# Altium schematic sheet RS232_485_SDcard.SchDoc
size A4
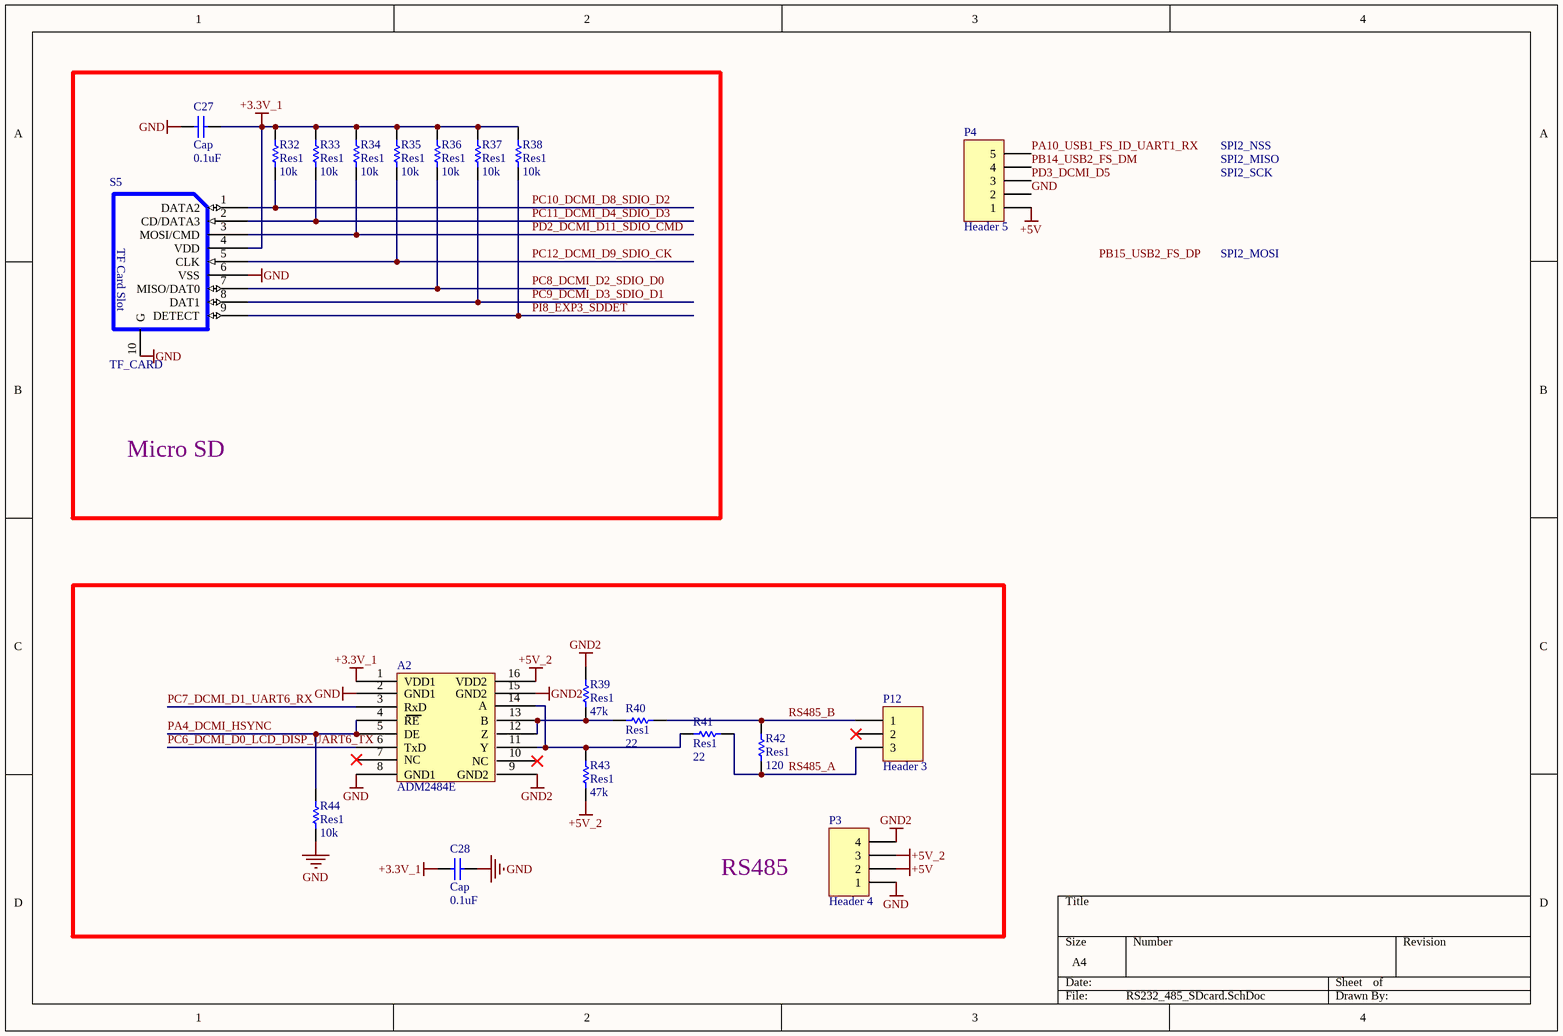
[diagram p0: RS232_485_SDcard.SchDoc]

## Parts
A2  ADM2484E  [RW-16]
C27  Cap  value 0.1uF  [0805_C]
C28  Cap  value 0.1uF  [0805_C]
P3  Header 4  [B0505S-1W]
P4  Header 5  [DIN 固定座 方型 5P TO PCB 2003]
P12  Header 3  [歐式端子*3p]
R32  Res1  value 10k  [0805_C]
R33  Res1  value 10k  [0805_C]
R34  Res1  value 10k  [0805_C]
R35  Res1  value 10k  [0805_C]
R36  Res1  value 10k  [0805_C]
R37  Res1  value 10k  [0805_C]
R38  Res1  value 10k  [0805_C]
R39  Res1  value 47k  [0805_C]
R40  Res1  value 22  [0805_C]
R41  Res1  value 22  [0805_C]
R42  Res1  value 120  [0805_C]
R43  Res1  value 47k  [0805_C]
R44  Res1  value 10k  [0805_C]
S5  TF_CARD  [TF-CARD]

## Blocks framed on the sheet
Micro SD: C27 R32-R38 S5
RS485: A2 C28 P3 P12 R39-R44

## Nets
+3.3V_1: A2.1(VDD1) C27.1 C28.1 R32.1 R33.1 R34.1 R35.1 R36.1 R37.1 R38.1 S5.4(VDD)
+5V: P3.2 P4.1
+5V_2: A2.16(VDD2) P3.3 R43.2
GND: A2.2(GND1) A2.8(GND1) C27.2 C28.2 P3.1 P4.2 R44.1 S5.6(VSS) S5.10(G)
GND2: A2.9(GND2) A2.15(GND2) P3.4 R39.1
PA4_DCMI_HSYNC: A2.4(RE) A2.5(DE) R44.2
PA10_USB1_FS_ID_UART1_RX: P4.5
PB14_USB2_FS_DM: P4.4
PC6_DCMI_D0_LCD_DISP_UART6_TX: A2.6(TxD)
PC7_DCMI_D1_UART6_RX: A2.3(RxD)
PC8_DCMI_D2_SDIO_D0: R36.2 S5.7(MISO/DAT0)
PC9_DCMI_D3_SDIO_D1: R37.2 S5.8(DAT1)
PC10_DCMI_D8_SDIO_D2: R32.2 S5.1(DATA2)
PC11_DCMI_D4_SDIO_D3: R33.2 S5.2(CD/DATA3)
PC12_DCMI_D9_SDIO_CK: R35.2 S5.5(CLK)
PD2_DCMI_D11_SDIO_CMD: R34.2 S5.3(MOSI/CMD)
PD3_DCMI_D5: P4.3
PI8_EXP3_SDDET: R38.2 S5.9(DETECT)
RS485_A: P12.3 R41.1 R42.2
RS485_B: P12.1 R40.1 R42.1
NetA2_11: A2.11(Y) A2.14(A) R41.2 R43.1
NetA2_12: A2.12(Z) A2.13(B) R39.2 R40.2

Not connected (* = marked no-connect by the designer): A2 7(NC)* 10(NC)*; P12 2*

## Notes on the sheet
- SPI2_NSS
- SPI2_MISO
- SPI2_SCK
- SPI2_MOSI
- Labels drawn without touching a wire or pin: PB15_USB2_FS_DP
- (in symbol TF_CARD) TF Card Slot

## Library data of the parts
C27 C28 = Cap: Capacitor; Published: 8-Jun-2000; LatestRevisionDate: 17-Jul-2002; LatestRevisionNote: Re-released for DXP Platform.; PackageReference: RAD-0.3; Publisher: Altium Limited; PackageDescription: Radial Cap, Thru-Hole; 2 Leads; 0.3 in Pin Spacing
P3 = Header 4: Header, 4-Pin; LatestRevisionDate: 17-Jul-2002; LatestRevisionNote: Re-released for DXP Platform.; Publisher: Altium Limited
P4 = Header 5: Header, 5-Pin; LatestRevisionDate: 17-Jul-2002; LatestRevisionNote: Re-released for DXP Platform.; Publisher: Altium Limited
P12 = Header 3: Header, 3-Pin; LatestRevisionDate: 17-Jul-2002; LatestRevisionNote: Re-released for DXP Platform.; Publisher: Altium Limited
R32-R44 = Res1: Resistor; Published: 8-Jun-2000; LatestRevisionDate: 17-Jul-2002; LatestRevisionNote: Re-released for DXP Platform.; PackageReference: AXIAL-0.3; Publisher: Altium Limited; PackageDescription: Axial Device, Thru-Hole; 2 Leads; 0.3 in Pin Spacing